# Altium schematic sheet MIXR Power - Connectors.SchDoc: Title
size B; Organization: Midnight Sun Solar Rayce Car Team; Address1: University of Waterloo; Address2: 200 University Ave W; Address3: Waterloo, ON, Canada; Address4: N2L 3E9; DocumentNumber: 2; SheetNumber: 2; SheetTotal: 5; Website: www.uwmidsun.com; ProjectName: ProjectName
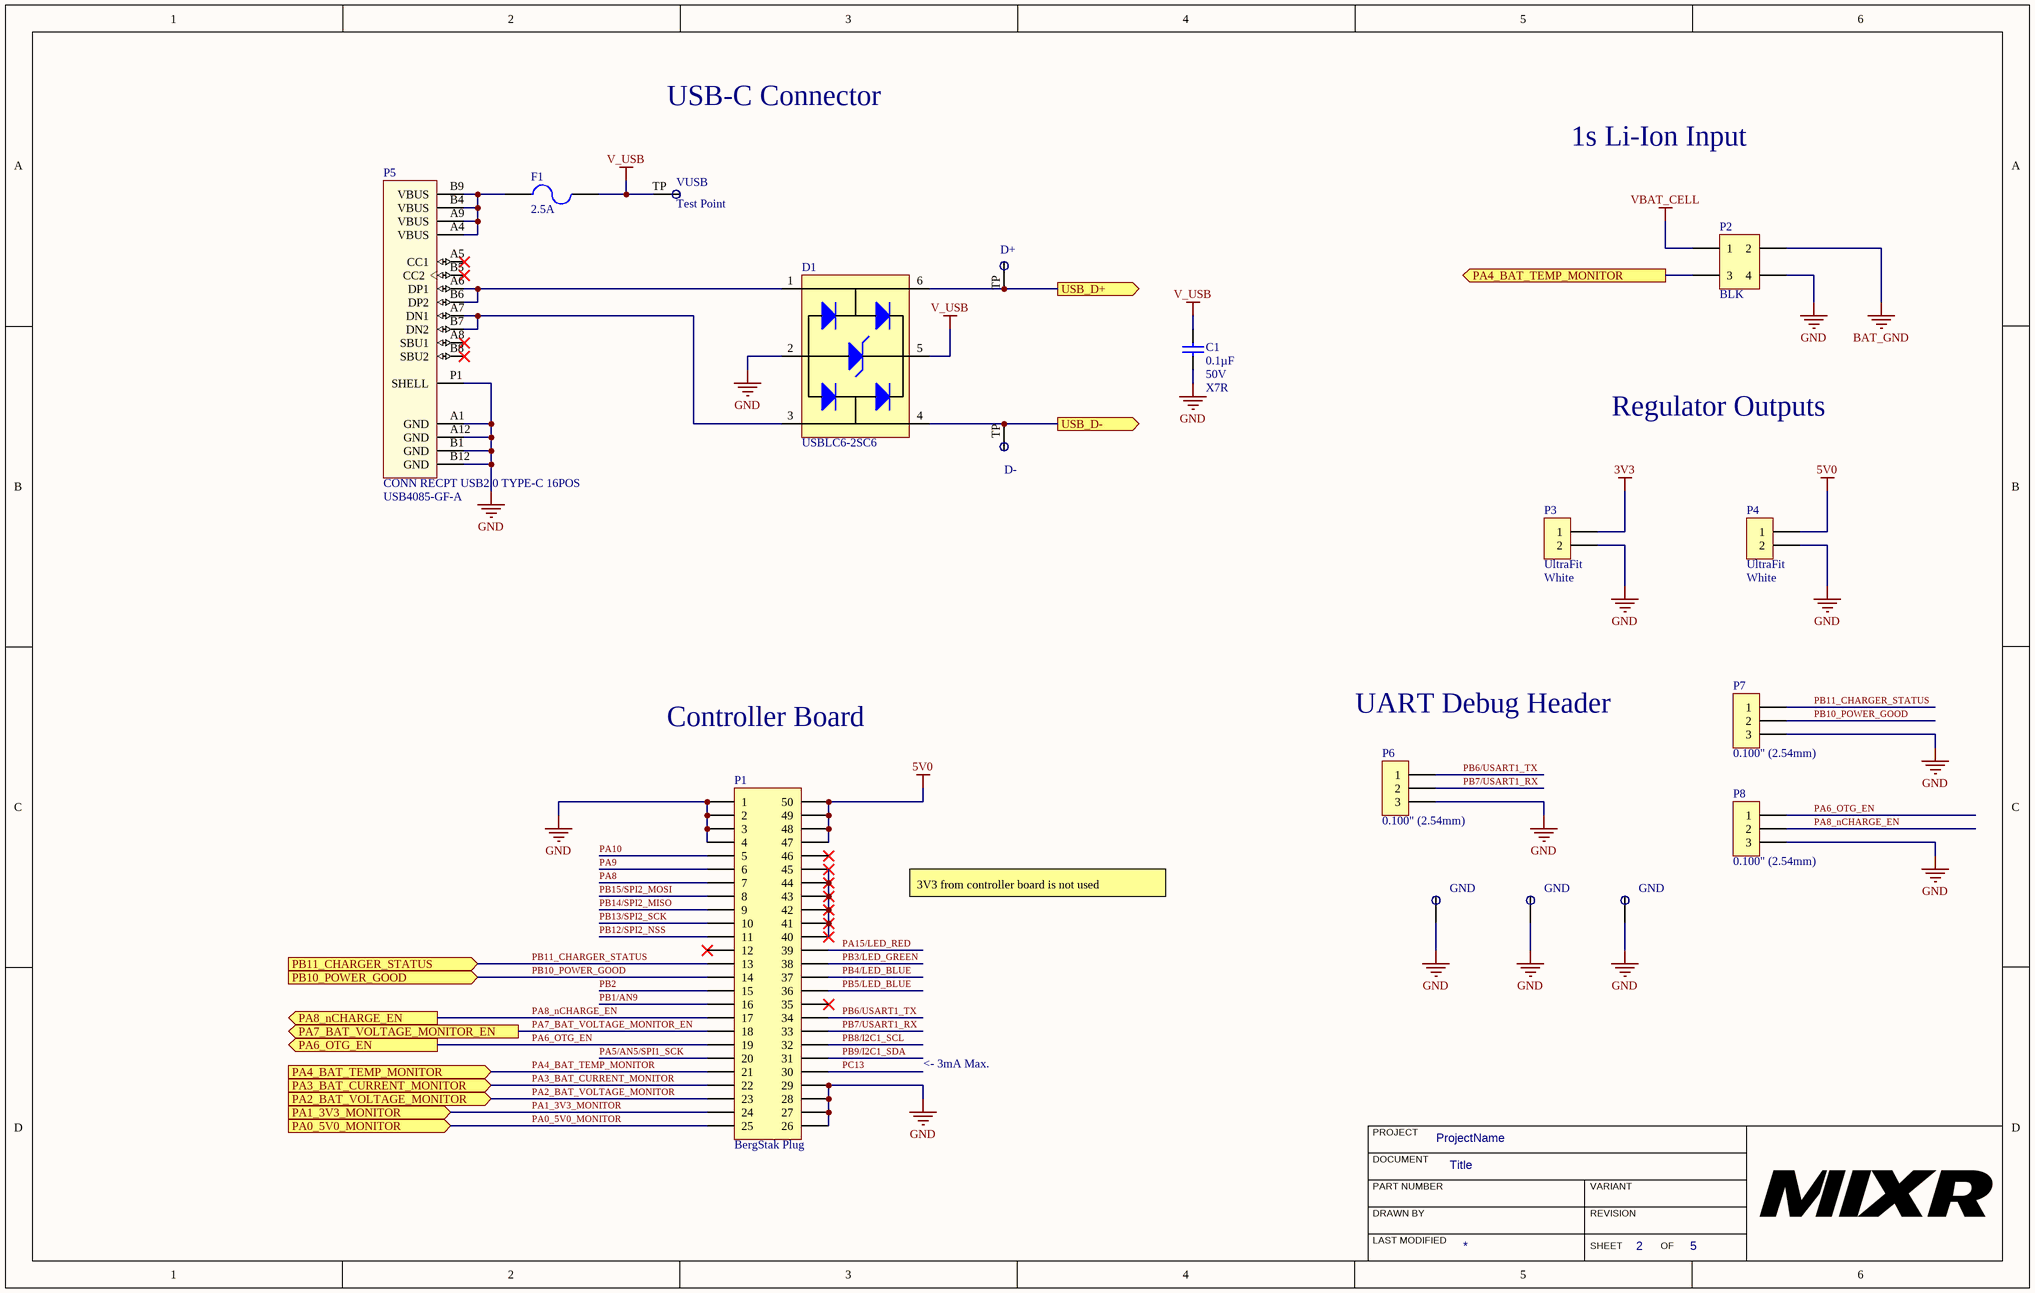
[diagram p0: MIXR Power - Connectors.SchDoc]

## Parts
(Parts that share a designator on the sheet are numbered #1, #2 ... from top to bottom, then left to right.)
C1  Capacitance: 0.1µF  Voltage: 50V  Temperature Coefficient: X7R  [CAP, 0603]  (hidden comment: CAP CER 0.1UF 50V 10% X7R 0603)
D1  Manufacturer Part Number 1: USBLC6-2SC6  [SOT23-6]  (hidden comment: DIODE TVS 5.25V 17V SOT23-6)
D+  Test Point  [Test Point]  (value not drawn)  (no BOM)
D-  Test Point  [Test Point]  (value not drawn)  (no BOM)
F1  Current Rating: 2.5A  [FUSE LITTLEFUSE 0466 1206]  (hidden comment: FUSE 2.5A 32VDC 1206)
GND#1  Thru Test Point  [Thru Test Point]  (value not drawn)
GND#2  Thru Test Point  [Thru Test Point]  (value not drawn)
GND#3  Thru Test Point  [Thru Test Point]  (value not drawn)
P1  Series: BergStak Plug  [CONN, Bergstak 50 Pos Plug]  (hidden comment: CONN 50POS Bergstak Plug 0.02")
P2  BLK  [CONN, 4POS 2 ROW ULTRA-FIT]
P3  Series: UltraFit  Color: White  [CONN, 2POS ULTRA-FIT - NATURAL COLOR]  (hidden comment: CONN 2POS ULTRA-FIT NATURAL COLOR 0.138")
P4  Series: UltraFit  Color: White  [CONN, 2POS ULTRA-FIT - NATURAL COLOR]  (hidden comment: CONN 2POS ULTRA-FIT NATURAL COLOR 0.138")
P5  CONN RECPT USB2.0 TYPE-C 16POS  Manufacturer Part Number: USB4085-GF-A  [CONN RECPT USB2.0 TYPE C 16-POS]
P6  Pitch - Mating: 0.100" (2.54mm)  [CONN, 3POS 0.100" Header, 1 ROW]  (hidden comment: CONN 3POS HEADR MALE 0.1")
P7  Pitch - Mating: 0.100" (2.54mm)  [CONN, 3POS 0.100" Header, 1 ROW]  (hidden comment: CONN 3POS HEADR MALE 0.1")
P8  Pitch - Mating: 0.100" (2.54mm)  [CONN, 3POS 0.100" Header, 1 ROW]  (hidden comment: CONN 3POS HEADR MALE 0.1")
VUSB  Test Point  [Test Point]  (no BOM)

## Ports
PA0_5V0_MONITOR (in), PA1_3V3_MONITOR (in), PA2_BAT_VOLTAGE_MONITOR (in), PA3_BAT_CURRENT_MONITOR (in), PA4_BAT_TEMP_MONITOR (in), PA4_BAT_TEMP_MONITOR (out), PA6_OTG_EN (out), PA7_BAT_VOLTAGE_MONITOR_EN (out), PA8_nCHARGE_EN (out), PB10_POWER_GOOD (in), PB11_CHARGER_STATUS (in), USB_D+ (out), USB_D- (out)

## Nets
3V3: P3.1
5V0: P1.47 P1.48 P1.49 P1.50 P4.1
BAT_GND: P2.2
GND: C1.2 D1.2(Cathode2) GND#1.TH_TP GND#2.TH_TP GND#3.TH_TP P1.1 P1.2 P1.3 P1.4 P1.26 P1.27 P1.28 P1.29 P2.4 P3.2 P4.2 P5.A1(GND) P5.A12(GND) P5.B1(GND) P5.B12(GND) P5.P1(SHELL) P6.3 P7.3 P8.3
V_USB: C1.1 D1.5(Cathode4) F1.2 VUSB.TP
VBAT_CELL: P2.1
PA0_5V0_MONITOR: P1.25 ; port PA0_5V0_MONITOR
PA1_3V3_MONITOR: P1.24 ; port PA1_3V3_MONITOR
PA2_BAT_VOLTAGE_MONITOR: P1.23 ; port PA2_BAT_VOLTAGE_MONITOR
PA3_BAT_CURRENT_MONITOR: P1.22 ; port PA3_BAT_CURRENT_MONITOR
PA4_BAT_TEMP_MONITOR: P1.21 P2.3 ; port PA4_BAT_TEMP_MONITOR
PA5/AN5/SPI1_SCK: P1.20
PA6_OTG_EN: P1.19 P8.1 ; port PA6_OTG_EN
PA7_BAT_VOLTAGE_MONITOR_EN: P1.18 ; port PA7_BAT_VOLTAGE_MONITOR_EN
PA8: P1.7
PA8_nCHARGE_EN: P1.17 P8.2 ; port PA8_nCHARGE_EN
PA9: P1.6
PA10: P1.5
PA15/LED_RED: P1.39
PB1/AN9: P1.16
PB2: P1.15
PB3/LED_GREEN: P1.38
PB4/LED_BLUE: P1.37
PB5/LED_BLUE: P1.36
PB6/USART1_TX: P1.34 P6.1
PB7/USART1_RX: P1.33 P6.2
PB8/I2C1_SCL: P1.32
PB9/I2C1_SDA: P1.31
PB10_POWER_GOOD: P1.14 P7.2 ; port PB10_POWER_GOOD
PB11_CHARGER_STATUS: P1.13 P7.1 ; port PB11_CHARGER_STATUS
PB12/SPI2_NSS: P1.11
PB13/SPI2_SCK: P1.10
PB14/SPI2_MISO: P1.9
PB15/SPI2_MOSI: P1.8
PC13: P1.30
USB_D+: D1.6(Cathode3) D+.TP ; port USB_D+
USB_D-: D1.4(Cathode2) D-.TP ; port USB_D-
NetD1_1: D1.1(Cathode3) P5.A6(DP1) P5.B6(DP2)
NetD1_3: D1.3(Cathode1) P5.A7(DN1) P5.B7(DN2)
NetF1_1: F1.1 P5.A4(VBUS) P5.A9(VBUS) P5.B4(VBUS) P5.B9(VBUS)
NetP1_40: P1.40 P1.41 P1.42 P1.43 P1.44 P1.45

Not connected (* = marked no-connect by the designer): P1 12* 35* 46*; P5 A5(CC1)* A8(SBU1)* B5(CC2)* B8(SBU2)*

## Notes on the sheet
- USB-C Connector
- 1s Li-Ion Input
- Regulator Outputs
- Controller Board
- UART Debug Header
- 3V3 from controller board is not used
- <- 3mA Max.
- PROJECT
- DOCUMENT
- DRAWN BY
- LAST MODIFIED
- PART NUMBER
- REVISION
- SHEET
- VARIANT
- OF

## Library data of the parts
C1 = CAP CER 0.1UF 50V 10% X7R 0603: 0.10µF ±10% 50V Ceramic Capacitor X7R 0603 (1608 Metric); Manufacturer 1: AVX Corporation; Manufacturer Part Number 1: 06035C104KAT2A; Supplier 1: Digi-Key; Supplier Part Number 1: 478-5052-1-ND; Packaging: Cut Tape (CT); Part Status: Active; Operating Temperature: -55°C ~ 125°C; Ratings: -; Mounting Type: Surface Mount, MLCC; Package / Case: 0603 (1608 Metric); Size / Dimension: 0.063" L x 0.032" W (1.60mm x 0.81mm); Height - Seated (Max): -; Thickness (Max): 0.035" (0.90mm); Lead Spacing: -; Lead Style: -; ComponentLink1URL: http://datasheets.avx.com/X7RDielectric.pdf; ComponentLink1Description: http://datasheets.avx.com/X7RDielectric.pdf; Tolerance: ±10%
D1 = DIODE TVS 5.25V 17V SOT23-6: 17V Clamp 5A (8/20µs) Ipp Tvs Diode Surface Mount SOT-23-6; Manufacturer 1: STMicroelectronics; Data Rate: 480Mbps; Direction: Unidirectional; Capacitance: 3.5pF; Operating Supply Voltage: 1.1V; Number of Elements: 1; Number of Channels: 2; Reverse Breakdown Voltage: 6V; Working Voltage: 5V; Power Line Protection: Yes; Test Current: 1mA; Max Reverse Leakage Current: 150nA; Element Configuration: Dual; Supplier 1: Digi-Key; Stock 1: 7579; Pricing 1: 1=0.47000, 10=0.39900, 100=0.29820, 500=0.23430, 1000=0.18105 (USD); RoHS: Yes; Mount: Surface Mount; Case/Package: SOT-23; Number of Pins: 6; Contact Plating: Tin; Min Operating Temperature: -40°C; Max Operating Temperature: 125°C; Packaging: Tape and Reel; Package Quantity: 3000; Polarity: Unidirectional; Breakdown Voltage: 6V; Clamping Voltage: 17V; Termination: SMD/SMT; Number of Bidirectional Channels: 2; Reverse Standoff Voltage: 5.25V; Min Breakdown Voltage: 6V; ESD Protection: Yes; Max Breakdown Voltage: 6V; Leakage Current: 150nA; Peak Pulse Current: 5A; Length: 3.05mm; Height: 1.3mm; Width: 1.75mm; Depth: 1.75mm; Radiation Hardening: No; REACH SVHC: No SVHC; Lead Free: Lead Free; ComponentLink1URL: https://datasheet.ciiva.com/1268/1690354-1268384.pdf?src-supplier=Element14; ComponentLink1Description: https://datasheet.ciiva.com/1268/1690354-1268384.pdf?src-supplier=Element14; ComponentLink2URL: https://datasheet.ciiva.com/4508/cd00050750-113117-4508433.pdf?src-supplier=Mouser; ComponentLink2Description: https://datasheet.ciiva.com/4508/cd00050750-113117-4508433.pdf?src-supplier=Mouser; ComponentLink3URL: https://datasheet.ciiva.com/15143/getdatasheetpartid-148465-15143789.pdf?src-supplier=Verical; ComponentLink3Description: https://datasheet.ciiva.com/15143/getdatasheetpartid-148465-15143789.pdf?src-supplier=Verical; ComponentLink4URL: https://datasheet.ciiva.com/26787/usblc6-2sc6-26787908.pdf?src-supplier=IIIC; ComponentLink4Description: https://datasheet.ciiva.com/26787/usblc6-2sc6-26787908.pdf?src-supplier=IIIC; ComponentLink5URL: https://datasheet.ciiva.com/16200/cd00050750-16200026.pdf?src-supplier=Future+Electronics; ComponentLink5Description: https://datasheet.ciiva.com/16200/cd00050750-16200026.pdf?src-supplier=Future+Electronics; ComponentLink6URL: https://datasheet.ciiva.com/41444/001184109-da-01-en-ic-esd-protecti-usblc6-2sc6-sot-23-6-stm-41444156.pdf?src-supplier=Conrad; ComponentLink6Description: https://datasheet.ciiva.com/41444/001184109-da-01-en-ic-esd-protecti-usblc6-2sc6-sot-23-6-stm-41444156.pdf?src-supplier=Conrad; Supplier Part Number 1: 497-5235-1-ND
F1 = FUSE 2.5A 32VDC 1206: 2.5A 32V AC 32V DC Fuse Board Mount (Cartridge Style Excluded) Surface Mount 1206 (3216 Metric); Manufacturer 1: Littelfuse; Manufacturer Part Number 1: 046602.5NRHF; DC Cold Resistance: 24mR; Power Dissipation: 192.5mW; Approvals: UL; Supplier 1: Digi-Key; Stock 1: 4995; Pricing 1: 1=0.84000, 5=0.81200, 10=0.78700, 50=0.66180, 100=0.54930, 250=0.49940, 500=0.42450, 1000=0.37455 (USD); RoHS: Yes; Mount: Surface Mount; Case/Package: 1206; Case Code (Metric): 3216; Case Code (Imperial): 1206; Housing Material: Ceramic; Min Operating Temperature: -55°C; Max Operating Temperature: 90°C; Package Quantity: 5000; Voltage Rating (AC): 32V; Voltage Rating (DC): 32V; Packaging: Tape and Reel; Working Voltage: 32V; Fuse Type: Board Mount (Cartridge Style Excluded); Length: 3.18mm; Height: 0.023inch; Width: 0.06inch; Depth: 1.52mm; Lead Free: Lead Free; ComponentLink1URL: https://datasheet.ciiva.com/303/littelfuse-fuse-466-303217.pdf?src-supplier=Digi-Key; ComponentLink1Description: https://datasheet.ciiva.com/303/littelfuse-fuse-466-303217.pdf?src-supplier=Digi-Key; ComponentLink2URL: https://datasheet.ciiva.com/18652/littelfuse-fuse-466-datasheet-pdf-18652469.pdf?src-supplier=Digi-Key; ComponentLink2Description: https://datasheet.ciiva.com/18652/littelfuse-fuse-466-datasheet-pdf-18652469.pdf?src-supplier=Digi-Key; ComponentLink3URL: https://datasheet.ciiva.com/16327/littelfuse-fuse-466-16327471.pdf?src-supplier=Future+Electronics; ComponentLink3Description: https://datasheet.ciiva.com/16327/littelfuse-fuse-466-16327471.pdf?src-supplier=Future+Electronics; Supplier Part Number 1: F6143CT-ND
P1 = CONN 50POS Bergstak Plug 0.02": 50 Position Connector Plug, Outer Shroud Contacts Surface Mount Gold; Manufacturer 1: Amphenol FCI; Manufacturer Part Number 1: 10132797-055100LF; Number of Positions: 50; Mated Stacking Heights: 5mm; Pitch: 0.020" (0.50mm); Supplier 1: Digi-Key; Supplier Part Number 1: 609-5226-1-ND; Packaging: Cut Tape (CT); Part Status: Active; Connector Type: Plug, Outer Shroud Contacts; Number of Rows: 2; Mounting Type: Surface Mount; Contact Finish: Gold; Contact Finish Thickness: 1µin (0.025µm); Height Above Board: 0.169" (4.30mm); ComponentLink1URL: http://portal.fciconnect.com/Comergent//fci/drawing/10132797.pdf; ComponentLink1Description: http://portal.fciconnect.com/Comergent//fci/drawing/10132797.pdf
P2 = CONN 4POS 2 ROW ULTRA-FIT 0.138": Connector Header Through Hole 4 position 0.138" (3.50mm); Manufacturer 1: Molex; Manufacturer Part Number 1: 1722991104; Description 1: ULTRA-FIT HDR VT DUAL F BLK 04CKT TIN; Number of Positions: 4; Connector Type: Male Pin; Pitch: 0.138inch; Row Spacing: 0.181inch; Supplier 1: Digi-Key; Supplier Part Number 1: WM11777-ND; Stock 1: 958; Pricing 1: 1=0.86, 10=0.753, 100=0.6494, 500=0.53136, 1000=0.47232, 5000=0.41328, 10000=0.39262 (USD); Mount: Through Hole; Colour: Black; Contact Plating: Tin; Packaging: Tray; Number of Rows: 2; Termination: Solder; Fastening Type: Latch; ComponentLink1URL: http://www.literature.molex.com/SQLImages/kelmscott/Molex/PDF_Images/987651-1008.pdf; ComponentLink1Description: http://www.literature.molex.com/SQLImages/kelmscott/Molex/PDF_Images/987651-1008.pdf
P3 P4 = CONN 2POS ULTRA-FIT NATURAL COLOR 0.138": 2 Positions Header, Shrouded Connector 0.138" (3.50mm) Through Hole; Manufacturer 1: Molex, LLC; Manufacturer Part Number 1: 1722872102; Style: Board to Cable/Wire; Shrouding: Shrouded - 4 Wall; Number of Positions: 2; Number of Positions Loaded: All; Contact Length - Post: 0.126" (3.20mm); Material Flammability Rating: UL94 V-0; Mated Stacking Heights: 26.99mm; Voltage: 400V; Supplier 1: Digi-Key; Supplier Part Number 1: WM11722-ND; Packaging: Tray; Part Status: Active; Connector Type: Header; Contact Type: Male Pin; Pitch - Mating: 0.138" (3.50mm); Number of Rows: 1; Row Spacing - Mating: -; Mounting Type: Through Hole; Termination: Solder; Fastening Type: Latch Holder; Contact Length - Mating: -; Overall Contact Length: -; Insulation Height: 0.465" (11.80mm); Contact Shape: Square; Contact Finish - Mating: Tin; Contact Finish Thickness - Mating: 60µin (1.52µm); Contact Finish - Post: Tin; Contact Material: Copper Alloy; Insulation Material: Liquid Crystal Polymer (LCP); Operating Temperature: -40°C ~ 105°C; Ingress Protection: -; Insulation Color: Natural; Current Rating: -; Contact Finish Thickness - Post: 60µin (1.52µm); ComponentLink1URL: http://www.molex.com/pdm_docs/sd/1722872102_sd.pdf; ComponentLink1Description: http://www.molex.com/pdm_docs/sd/1722872102_sd.pdf
P5 = CONN RECPT USB2.0 TYPE-C 16POS: USB - C USB 2.0 Receptacle Connector 16 Position Through Hole, Right Angle; Manufacturer: Global Connector Technology; Supplier 1: Digi-Key; Supplier Part Number 1: 2073-USB4085-GF-ACT-ND; Stock 1: 286; Pricing 1: 1 = 1.440000, 10 = 1.307000, 25 = 1.227200, 50 = 1.174000, 100 = 1.120600, 250 = 1.013840 (USD); RoHS: No
P6-P8 = CONN 3POS HEADR MALE 0.1": 3 Positions Header Connector 0.100" (2.54mm) Through Hole Gold; Manufacturer 1: Wurth Electronics Inc.; Manufacturer Part Number 1: 61300311121; Style: Board to Board or Cable; Shrouding: Unshrouded; Number of Positions: 3; Number of Positions Loaded: All; Contact Length - Mating: 0.236" (6.00mm); Contact Length - Post: 0.118" (3.00mm); Overall Contact Length: 0.454" (11.54mm); Material Flammability Rating: UL94 V-0; Current Rating: 3A; Voltage: 250V; Supplier 1: Digi-Key; Supplier Part Number 1: 732-5316-ND; Packaging: Bulk; Part Status: Active; Connector Type: Header; Contact Type: Male Pin; Number of Rows: 1; Row Spacing - Mating: -; Mounting Type: Through Hole; Termination: Solder; Fastening Type: -; Insulation Height: 0.100" (2.54mm); Contact Shape: Square; Contact Finish - Mating: Gold; Contact Finish Thickness - Mating: -; Contact Finish - Post: -; Contact Material: Copper Alloy; Insulation Material: Polybutylene Terephthalate (PBT); Operating Temperature: -40°C ~ 125°C; Ingress Protection: -; Insulation Color: Black; Mated Stacking Heights: -; Contact Finish Thickness - Post: -; ComponentLink1URL: http://katalog.we-online.de/em/datasheet/6130xx11121.pdf; ComponentLink1Description: http://katalog.we-online.de/em/datasheet/6130xx11121.pdf